# Altium schematic sheet BOARD-connector.SchDoc
size A4; Organization: Altium Limited; Address1: L3, 12a Rodborough Rd; Address2: Frenchs Forest; Address3: NSW; Address4: Australia 2086
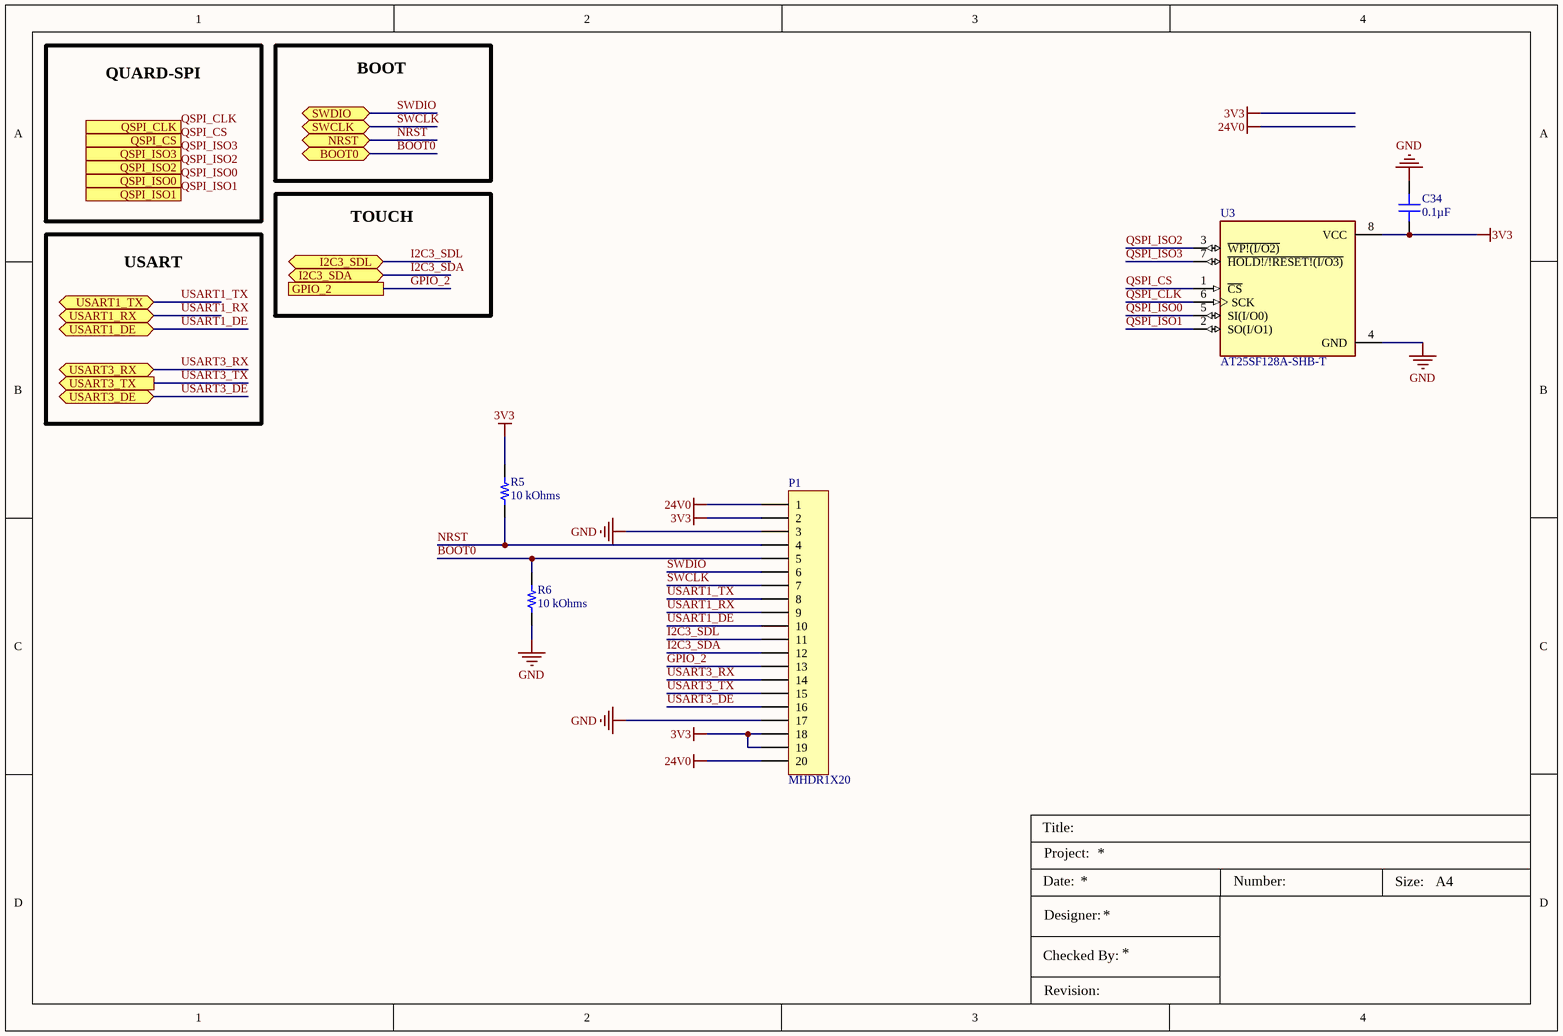
[diagram p0: BOARD-connector.SchDoc]

## Parts
C34  0.1µF  [CAP 0603_1608]
P1  MHDR1X20  [MHDR1X20]
R5  10 kOhms  [RES 0603_1608]
R6  10 kOhms  [RES 0603_1608]
U3  AT25SF128A-SHB-T  [SOIC127P790X216-8N]

## Ports
BOOT0 (bidir), GPIO_2, I2C3_SDA (bidir), I2C3_SDL (bidir), NRST (bidir), QSPI_CLK, QSPI_CS, QSPI_ISO0, QSPI_ISO1, QSPI_ISO2, QSPI_ISO3, SWCLK (bidir), SWDIO (bidir), USART1_DE (bidir), USART1_RX (bidir), USART1_TX (bidir), USART3_DE (bidir), USART3_RX (bidir), USART3_TX (out)

## Nets
3V3: C34.1 P1.2 P1.18 P1.19 R5.2 U3.8(VCC)
24V0: P1.1 P1.20
GND: C34.2 P1.3 P1.17 R6.1 U3.4(GND)
BOOT0: P1.5 R6.2 ; port BOOT0
GPIO_2: P1.13 ; port GPIO_2
I2C3_SDA: P1.12 ; port I2C3_SDA
I2C3_SDL: P1.11 ; port I2C3_SDL
NRST: P1.4 R5.1 ; port NRST
QSPI_CLK: U3.6(SCK) ; port QSPI_CLK
QSPI_CS: U3.1(~{CS}) ; port QSPI_CS
QSPI_ISO0: U3.5(SI(I/O0)) ; port QSPI_ISO0
QSPI_ISO1: U3.2(SO(I/O1)) ; port QSPI_ISO1
QSPI_ISO2: U3.3(~{WP!(I/O2)}) ; port QSPI_ISO2
QSPI_ISO3: U3.7(~{HOLD!/!RESET!(I/O3)}) ; port QSPI_ISO3
SWCLK: P1.7 ; port SWCLK
SWDIO: P1.6 ; port SWDIO
USART1_DE: P1.10 ; port USART1_DE
USART1_RX: P1.9 ; port USART1_RX
USART1_TX: P1.8 ; port USART1_TX
USART3_DE: P1.16 ; port USART3_DE
USART3_RX: P1.14 ; port USART3_RX
USART3_TX: P1.15 ; port USART3_TX

## Notes on the sheet
- QUARD-SPI
- BOOT
- TOUCH
- USART
- Title:
- Project:
- Date:
- Designer:
- Number:
- Size:
- A4
- Checked By:
- Revision:

## Library data of the parts
C34 = 6R3X14W104MV4T: CAP CER 0.1UF 6.3V X7R 0603; Part Number: 6R3X14W104MV4T; Value: 0.1µF
P1 = MHDR1X20: Header, 20-Pin; LatestRevisionDate: 17-Jul-2002; LatestRevisionNote: Re-released for DXP Platform.; Publisher: Altium Limited
R5 R6 = CRCW060310K0FKEAHP: RES SMD 10K OHM 1% 1/4W 0603; Part Number: CRCW060310K0FKEAHP; Value: 10 kOhms
U3 = AT25SF128A-SHB-T: 128 Mbit Serial NOR Flash Memory with Dual and Quad I/O Support; MF: Dialog Semiconductor; Value: *; Purchase-URL: https://pricing.snapeda.com/search/part/AT25SF128A-SHB-T/?ref=eda; Package: SOIC-8 Dialog Semiconductor; MP: AT25SF128A-SHB-T; Check_prices: https://www.snapeda.com/parts/AT25SF128A-SHB-T/Dialog%20Semiconductor/view-part/5488499/?ref=eda; SnapEDA_Link: https://www.snapeda.com/parts/AT25SF128A-SHB-T/Dialog%20Semiconductor/view-part/5488499/?ref=snap; Price: None; Availability: Warning